# Altium project SmartWatch.PrjPcb (part 3 of 3)

## Sheet [6] VibrationMotor.SchDoc: Vibration Motor
size A4; ApprovedBy: Muhammet YILDIZ; CheckedBy: Muhammet YILDIZ; Author: Muhammet YILDIZ; CompanyName: YıLDıZ IoT; DrawnBy: Muhammet YILDIZ; Engineer: Muhammet YILDIZ; Organization: YıLDıZ IoT; Address1: Elperek Mahallesi; Address2: Saray Sokak No:12; Address3: SAKARYA / TURKEY; Revision: 1; SheetSize: A4
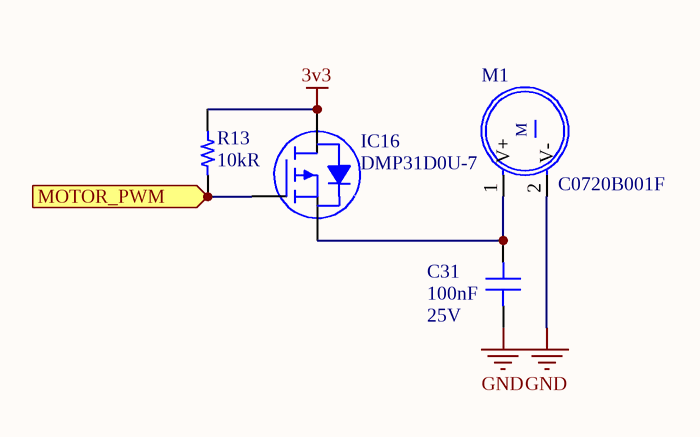
[diagram p6: [6] VibrationMotor.SchDoc]

### Parts
C31  100nF  Voltage Rating (DC): 25V  [CAP 0402/1005]
IC16  DMP31D0U-7  [DIODES SOT-23-3]
M1  C0720B001F  [VYBRONICS C0720B001F]
R13  10kR  [RES 0402/1005]

### Ports
MOTOR_PWM (in)

### Nets
3v3: IC16.3(D) R13.2
GND: C31.1 M1.2(V-)
MOTOR_PWM: IC16.1(G) R13.1 ; port MOTOR_PWM
NetC31_2: C31.2 IC16.2(S) M1.1(V+)

### Notes on the sheet
- Title:
- Size:
- Project:
- Revision:
- Sheet
- of
- Date:
- YıLDıZ IoT
- Elperek Mahallesi
- Saray Sokak, No:12
- SAKARYA / TURKEY
- File:
- (in symbol VYBRONICS C0720B001F) M

### Library data of the parts
C31 = Capacitor - Ceramic: Cap Ceramic 0.1uF 25V X5R 10% Pad SMD 0402 85¡ãC T/R / Multi Layer Ceramic Capacitor (MLCC); Manufacturer: Samsung; Manufacturer Part Number: CL05A104KA5NNNC; Supplier 1: Digi-Key; Supplier Part Number 1: 1276-1043-6-ND; RoHS: Yes; Category: Ceramic Capacitors; Pricing 1: 1=0,10000, 10=0,01100, 50=0,00600, 100=0,00490, 500=0,00346, 1000=0,00272, 2500=0,00248, 5000=0,00228 (USD); Mount: Surface Mount; Case/Package: 0402; Case Code (Imperial): 0402; Case Code (Metric): 1005; Min Operating Temperature: -55°C; Max Operating Temperature: 85°C; Capacitance: 100nF; Packaging: Tape and Reel; Tolerance: 10%; Package Quantity: 1; Voltage Rating: 25V; Dielectric: X5R; Voltage: 25V; Length: 1mm; Width: 0.02inch; Height: 0.5mm; Thickness: 0.022inch; Depth: 0.5mm; Radiation Hardening: No; Lead Free: Lead Free; ComponentLink1URL: https://datasheet.ciiva.com/25802/cl05a104ka5nnnc-25802704.pdf?src-supplier=Digi-Key; ComponentLink1Description: https://datasheet.ciiva.com/25802/cl05a104ka5nnnc-25802704.pdf?src-supplier=Digi-Key; ComponentLink2URL: https://datasheet.ciiva.com/16437/cl05a104ka5nnnc-16437369.pdf?src-supplier=Future+Electronics; ComponentLink2Description: https://datasheet.ciiva.com/16437/cl05a104ka5nnnc-16437369.pdf?src-supplier=Future+Electronics; ComponentLink3URL: https://datasheet.ciiva.com/26838/getdatasheetpartid-357412-26838142.pdf?src-supplier=Verical; ComponentLink3Description: https://datasheet.ciiva.com/26838/getdatasheetpartid-357412-26838142.pdf?src-supplier=Verical; ComponentLink4URL: https://datasheet.ciiva.com/26309/mlcc-catalogdownload2013-eng-26309014.pdf?src-supplier=Distrelec; ComponentLink4Description: https://datasheet.ciiva.com/26309/mlcc-catalogdownload2013-eng-26309014.pdf?src-supplier=Distrelec
IC16 = DMP31D0U-7: MOSFET P-CH 30V 530MA SOT23; Manufacturer: Diodes Incorporated; Current - Continuous Drain (Id) @ 25°C: 530mA (Ta); Drive Voltage (Max Rds On,  Min Rds On): 1.8V, 4.5V; FET Type: P-Channel; Gate Charge (Qg) (Max) @ Vgs: 0.9nC @ 4.5V; Input Capacitance (Ciss) (Max) @ Vds: 76pF @ 15V; Power Dissipation (Max): 450mW (Ta); Rds On (Max) @ Id, Vgs: 1Ohm @ 400mA, 4.5V; Vgs (Max): ±8V; Vgs(th) (Max) @ Id: 1.1V @ 250µA; Part Number: DMP31D0U-7; ComponentLink1Description: Datasheet; ComponentLink1URL: https://www.diodes.com/assets/Datasheets/DMP31D0U.pdf; ComponentLink2Description: DigiKey Link; ComponentLink2URL: http://digikey.com/product-detail/en/diodes-incorporated/DMP31D0U-7/DMP31D0U-7DICT-ND/4457888; Drain to Source Voltage (Vdss): 30V; LastUpdated: 02.09.2020 01:25:04; Lifecycle Status: Active; Minimum Order: 1; Mounting Type: Surface Mount; Operating Temperature: -55°C ~ 150°C (TJ); Package / Case: TO-236-3, SC-59, SOT-23-3; Packaging: TapeAndReel; Part Status: Active; Price: 0.09; Series: -; Supplier 1: DigiKey; Supplier Part Number 1: DMP31D0U-7DICT-ND; Supplier Device Package: SOT-23; Technology: MOSFET (Metal Oxide)
M1 = VYBRONICS C0720B001F: DC Motor Vibration, ERM 10000 RPM 3VDC; Supplier Part Number 1: 1670-VC0720B001F-ND; Manufacturer Part Number: C0720B001F
R13 = Resistor_Chip: Res Thick Film 0402 10K Ohm 1% 0.063W(1/16W) ±100ppm/C Pad SMD Automotive T/R; Manufacturer: Stackpole Electronics; Manufacturer Part Number: RMCF0402FT10K0; Power Rating: 62.5mW; Temperature Coefficient: 100ppm/°C; Max Power Dissipation: 63mW; Supplier 1: Digi-Key; Supplier Part Number 1: RMCF0402FT10K0DKR-ND; RoHS: Yes; Category: Chip SMD Resistors; Pricing 1: 1=0,10000, 10=0,01500, 100=0,00610, 1000=0,00274, 2500=0,00238, 5000=0,00197 (USD); Mount: Surface Mount; Case/Package: 0402; Case Code (Metric): 1005; Case Code (Imperial): 0402; Contact Plating: Tin,Matte; Size Code: 0402; Min Operating Temperature: -55°C; Max Operating Temperature: 155°C; Tolerance: 1%; Packaging: Tape and Reel; Resistance: 10kR; Resistor Type: Thick Film; Number of Terminations: 2; Features: Automotive AEC-Q200; Series: RMCF; Construction: Rectangular; Length: 1mm; Width: 0.02inch; Height: 0.016inch; Depth: 0.5mm; Radiation Hardening: No; Military Standard: Not; Lead Free: Lead Free; RoHS Compliant: Yes; ComponentLink1URL: https://datasheet.ciiva.com/24341/sei-rmcp-24341800.pdf?src-supplier=Onlinecomponents.com; ComponentLink1Description: https://datasheet.ciiva.com/24341/sei-rmcp-24341800.pdf?src-supplier=Onlinecomponents.com

## Nets that join several sheets
3v3: [1] Power (C2.2 IC1.10 IC1.12 R1.2), [2] MCU (FB1.1), [3] Sensor (8 pins), [4] TFT LCD (IC13.3 IC14.3 R8.2 R9.2), [5] Flash (C30.2 IC17.8 R12.2), [6] VibrationMotor (IC16.3 R13.2)
GND: [1] Power (11 pins), [2] MCU (17 pins), [3] Sensor (24 pins), [4] TFT LCD (9 pins), [5] Flash (C30.1 IC17.4), [6] VibrationMotor (C31.1 M1.2)
BATMON: [1] Power (R11.1 R15.2), [2] MCU (IC4.40)
BATMONEN: [1] Power (IC15.6 R14.2), [2] MCU (IC4.39)
CMD/DATA: [2] MCU (IC4.15), [4] TFT LCD (TFT1.5)
ENS210_PowerCTRL: [2] MCU (IC4.23), [3] Sensor (IC6.2)
FLASH_CLK: [2] MCU (IC4.5), [5] Flash (IC17.6)
FLASH_HOLD: [2] MCU (IC4.6), [5] Flash (IC17.7)
FLASH_MISO: [2] MCU (IC4.8), [5] Flash (IC17.2)
FLASH_MOSI: [2] MCU (IC4.4), [5] Flash (IC17.5)
FLASH_nCS: [2] MCU (IC4.7), [5] Flash (IC17.1 R12.1)
FLASH_WP: [2] MCU (IC4.9), [5] Flash (IC17.3)
ICP_PowerCTRL: [2] MCU (IC4.24), [3] Sensor (IC9.2)
LCD_MISO: [2] MCU (IC4.17), [4] TFT LCD (TFT1.7)
LCD_MOSI: [2] MCU (IC4.16), [4] TFT LCD (TFT1.6)
LCD_nCS: [2] MCU (IC4.19), [4] TFT LCD (TFT1.9)
LCD_nRST: [2] MCU (IC4.20), [4] TFT LCD (TFT1.10)
LCD_SCK: [2] MCU (IC4.18), [4] TFT LCD (TFT1.8)
LCD_TP_IRQ: [2] MCU (IC4.10), [4] TFT LCD (TFT1.21)
LCD_TP_nRST: [2] MCU (IC4.14), [4] TFT LCD (TFT1.18)
LCD_TP_SCL: [2] MCU (IC4.11), [4] TFT LCD (TFT1.20)
LCD_TP_SDA: [2] MCU (IC4.12), [4] TFT LCD (TFT1.19)
LIS2D_IRQ: [2] MCU (IC4.42), [3] Sensor (IC10.11)
LIS2D_PowerCTRL: [2] MCU (IC4.29), [3] Sensor (IC10.2)
LIS2MD_IRQ: [2] MCU (IC4.27), [3] Sensor (IC12.3)
LIS2MD_PowerCTRL: [2] MCU (IC4.28), [3] Sensor (IC12.2)
MOTOR_PWM: [2] MCU (IC4.37), [6] VibrationMotor (IC16.1 R13.1)
P0.18: [2] MCU (IC4.21), [3] Sensor (IC6.3 IC9.3 IC10.3 IC12.7)
P0.19: [2] MCU (IC4.22), [3] Sensor (IC6.7 IC9.7 IC10.7 IC12.11)